# Altium schematic sheet CT310高端控制盒方向组合按键电路V1.0.SchDoc
size A4
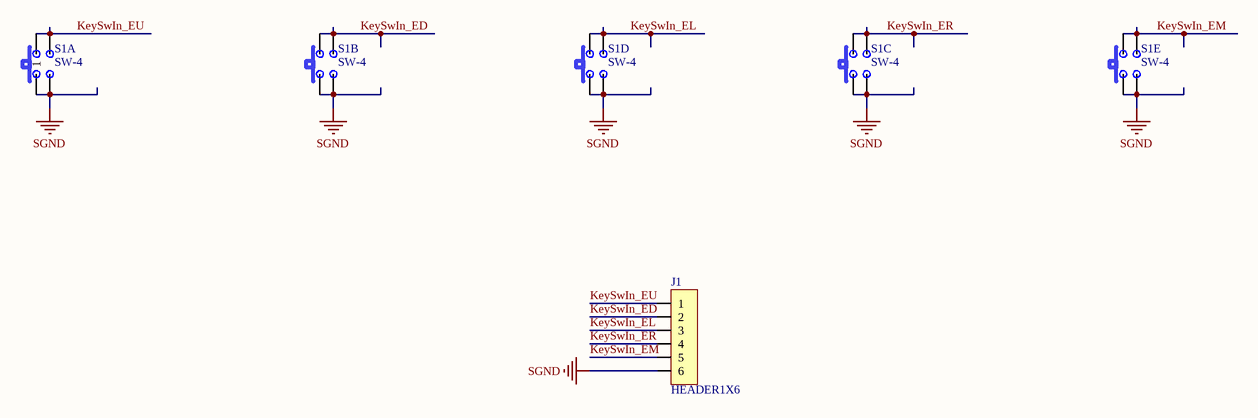
[diagram p0: CT310高端控制盒方向组合按键电路V1.0.SchDoc]

## Parts
J1  HEADER1X6  [ZH1X6WT-1.5]
S1  SW-4  [SW-MEC-5]  (parts A,B,C,D,E of 5)

## Nets
SGND: J1.6 S1.1 S1.3 S1.5 S1.7 S1.9
KeySwIn_ED: J1.2 S1.4
KeySwIn_EL: J1.3 S1.8
KeySwIn_EM: J1.5 S1.10
KeySwIn_ER: J1.4 S1.6
KeySwIn_EU: J1.1 S1.2